# EAGLE design RJ-45 Dash Daughter Board (EAGLE 8.6.0)
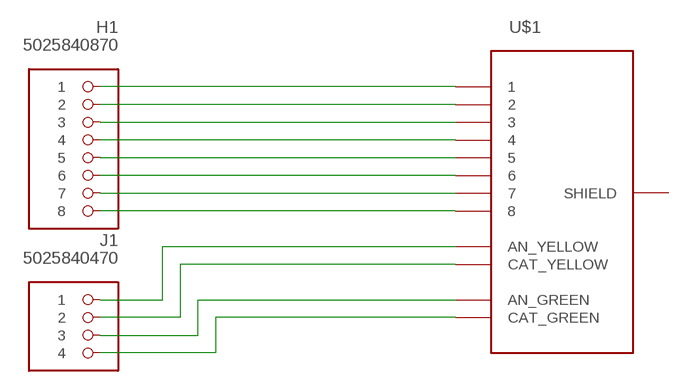
[diagram p0: schematic, sheet 1]

## Parts
H1  5025840870  MOLEX_CLICKMATE-8-VERTICAL  [MOLEX-CLIKMATE-8-VERTICAL-HEADER]
J1  5025840470  MOLEX_CLICKMATE-4-VERTICAL  [MOLEX-CLIKMATE-4-VERTICAL-HEADER]
U$1  RJ-45_12-PIN  [RJ-45]

## Nets
N$1: H1.1 U$1.P$1
N$2: H1.2 U$1.P$2
N$3: H1.3 U$1.P$3
N$4: H1.4 U$1.P$4
N$5: H1.5 U$1.P$5
N$6: H1.6 U$1.P$6
N$7: H1.7 U$1.P$7
N$8: H1.8 U$1.P$8
N$9: J1.1 U$1.P$9(AN_YELLOW)
N$10: J1.2 U$1.P$10(CAT_YELLOW)
N$11: J1.3 U$1.P$11(AN_GREEN)
N$12: J1.4 U$1.P$12(CAT_GREEN)
Unconnected: U$1.P$13(SHIELD)

## Library data of the parts
H1 = FormE:MOLEX_CLICKMATE-8-VERTICAL: 505405-0860
J1 = FormE:MOLEX_CLICKMATE-4-VERTICAL: 5025840470
U$1 = FormE:RJ-45_12-PIN

## Board
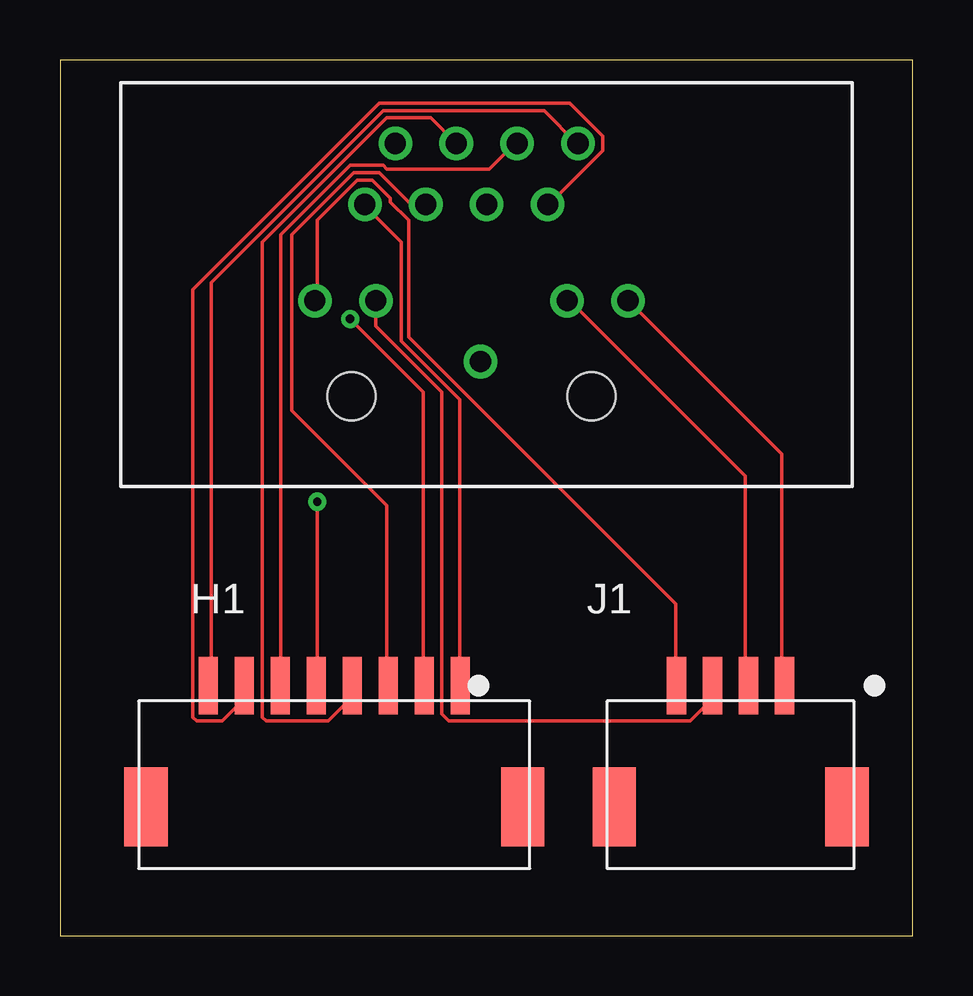
[diagram p1: board, top side]
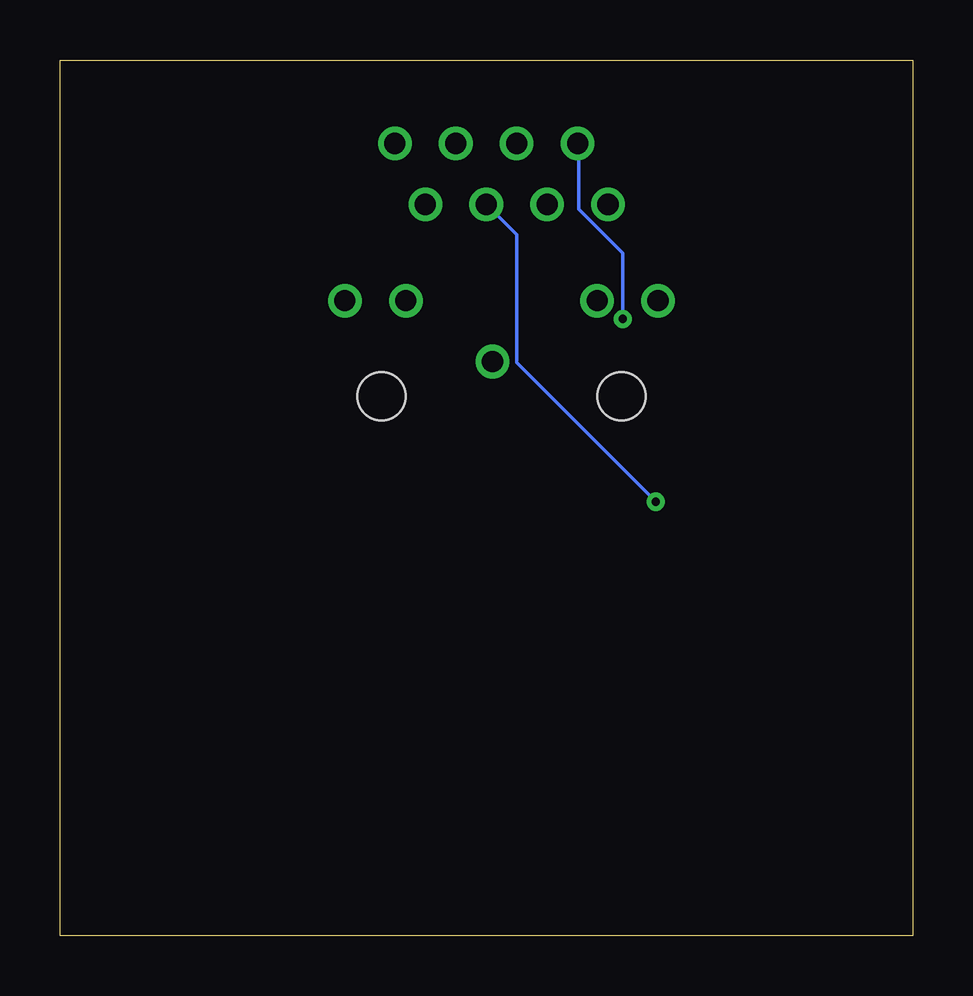
[diagram p2: board, bottom side, seen from below]

Size 35.54 x 36.5 mm. Coordinates in mm from the lower left corner, seen from the top.
Outline: 0,0 35.54,0 35.54,36.5 0,36.5 0,0
Copper layers (1*16): Top 0.035mm / dielectric 1.5mm / Bottom 0.035mm
Design rules "default": minimum track width 6mil, minimum drill 0.35mm, track to track 6mil, track to pad 6mil, pad to pad 6mil, via to via 6mil, smd to smd 6mil, copper to edge 40mil, drill to drill 6mil, minimum pad ring 10mil, minimum via ring 8mil, stop-mask expansion 4mil, vias tented up to drill 0mil, thermal gap 10mil

### Footprints (pad centres in the part's own frame; a part is rotated, then mirrored left to right if it is on the bottom)
MOLEX-CLIKMATE-8-VERTICAL-HEADER = smd 0.8 x 2.4: 1 5.25,4.064; 2 3.75,4.064; 3 2.25,4.064; 4 0.75,4.064; 5 -0.75,4.064; 6 -2.25,4.064; 7 -3.75,4.064; 8 -5.25,4.064 | smd 1.8 x 3.3: M1 7.85,-0.986; M2 -7.85,-0.986
MOLEX-CLIKMATE-4-VERTICAL-HEADER = smd 0.8 x 2.4: 1 2.25,4.064; 2 0.75,4.064; 3 -0.75,4.064; 4 -2.25,4.064 | smd 1.8 x 3.3: M1 4.85,-0.986; M2 -4.85,-0.986
RJ-45 = drill 0.889: P$1 0,0; P$2 1.27,2.54; P$3 2.54,0; P$4 3.81,2.54; P$5 5.08,0; P$6 6.35,2.54; P$7 7.62,0; P$8 8.89,2.54; P$9 10.973,-4.013; P$10 8.433,-4.013; P$11 0.457,-4.013; P$12 -2.083,-4.013; P$13 4.826,-6.553 | hole 2.007: -0.559,-8.001; 9.449,-8.001

### Placement (x,y rotation side)
H1  11.43,6.35 0 top
J1  27.94,6.35 0 top
U$1  12.7,30.48 0 top

### Tracks (layer width: path | path; a pad name or v marks a point on that pad's centre or on a via)
N$1
  Top 0.152: H1.1 16.66,10.46 16.66,22.35 14.22,24.79 14.22,28.91 12.7,30.43 U$1.P$1
N$2  (via drill 0.35)
  Top 0.152: v12.09,25.71 15.14,22.66 15.14,10.46 H1.2
  Bottom 0.152: v12.09,25.71 12.09,28.45 13.92,30.28 13.92,33.02 U$1.P$2
N$3
  Top 0.152: H1.3 13.61,10.46 13.61,17.93 9.65,21.9 9.65,29.21 12.24,31.8 13.31,31.8 14.53,30.58 15.14,30.58 U$1.P$3
N$4
  Top 0.152: U$1.P$4 15.44,34.09 13.61,34.09 8.43,28.91 8.43,9.09 8.59,8.94 11.18,8.94 12.09,9.85 12.09,10.31 H1.4
N$5  (via drill 0.35)
  Top 0.152: v10.72,18.09 10.72,10.46 H1.5
  Bottom 0.152: v10.72,18.09 16.51,23.88 16.51,29.21 U$1.P$5
N$6
  Top 0.152: H1.6 9.2,10.46 9.2,29.21 12.09,32.11 13.46,32.11 13.61,31.95 17.88,31.95 18.95,33.02 U$1.P$6
N$7
  Top 0.152: H1.7 7.67,10.31 7.67,9.85 6.76,8.94 5.69,8.94 5.54,9.09 5.54,26.92 13.31,34.7 21.23,34.7 22.61,33.33 22.61,32.71 20.32,30.43 U$1.P$7
N$8
  Top 0.152: H1.8 6.3,10.46 6.3,27.23 13.46,34.39 20.17,34.39 21.54,33.02 U$1.P$8
N$9
  Top 0.152: U$1.P$9 30.07,20.07 30.07,10.46 J1.1
N$10
  Top 0.152: J1.2 28.55,10.46 28.55,19.15 21.23,26.47 U$1.P$10
N$11
  Top 0.152: U$1.P$11 13.16,25.4 15.9,22.66 15.9,9.25 16.21,8.94 26.26,8.94 27.18,9.85 27.18,10.31 J1.3
N$12
  Top 0.152: J1.4 25.65,10.46 25.65,13.82 14.53,24.94 14.53,29.82 13.77,30.58 13.77,30.73 13.01,31.5 12.4,31.5 10.72,29.82 10.72,26.47 U$1.P$12